# EAGLE design antenna_analyzer_rev7 (EAGLE 6.6.0)
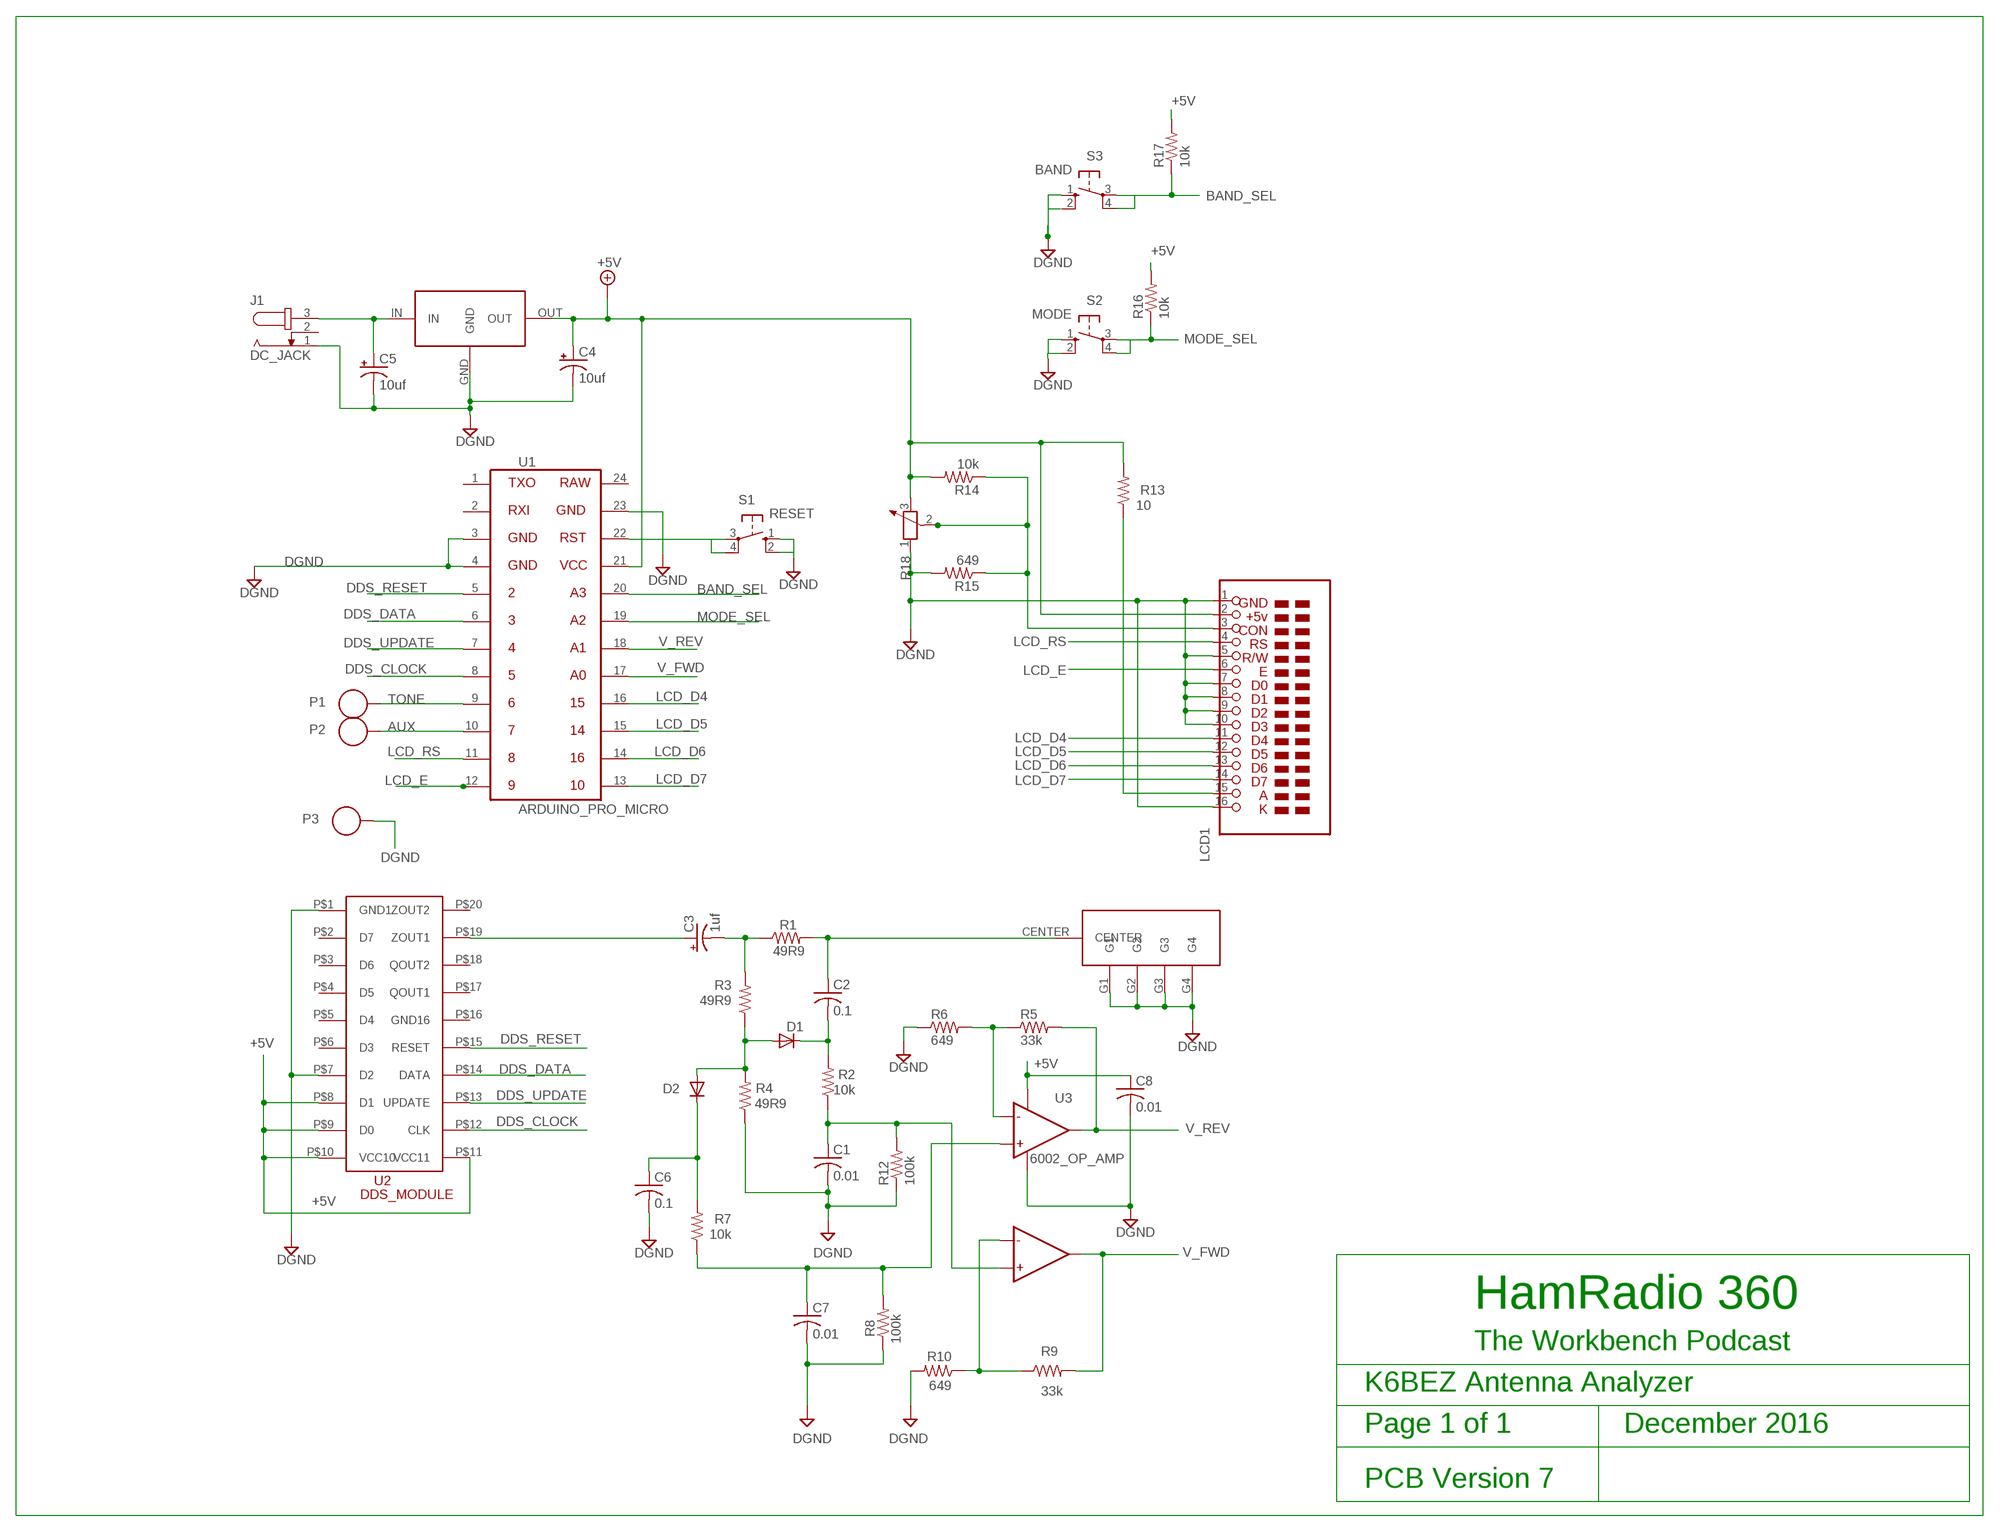
[diagram p0: schematic, sheet 1]

## Parts
C1  0.01  C-US025-025X050  [C025-025X050]
C2  0.1  C-US025-025X050  [C025-025X050]
C3  1uf  CPOL-USE1.8-4  [E1,8-4]
C4  10uf  CPOL-USE1.8-4  [E1,8-4]
C5  10uf  CPOL-USE1.8-4  [E1,8-4]
C6  0.1  C-US025-025X050  [C025-025X050]
C7  0.01  C-US025-025X050  [C025-025X050]
C8  0.01  C-US025-025X050  [C025-025X050]
CON1  BNC-SMALL  [BNC-SMALL]
D1  AA143  1N4148DO35-7  [DO35-7]
D2  AA143  1N4148DO35-7  [DO35-7]
J1  DC_JACK  [DC_COAXIAL_JACK]
LCD1  LCD_2_16  [LCD_2X16]
P1  SOLDER_PAD_35_HOLE  [SOLDER_PAD_35_HOLE]
P2  SOLDER_PAD_35_HOLE  [SOLDER_PAD_35_HOLE]
P3  SOLDER_PAD_35_HOLE  [SOLDER_PAD_35_HOLE]
R1  49R9  R-US_0207/10  [0207/10]
R2  10k  R-US_0207/10  [0207/10]
R3  49R9  R-US_0207/10  [0207/10]
R4  49R9  R-US_0207/10  [0207/10]
R5  33k  R-US_0207/10  [0207/10]
R6  649  R-US_0207/10  [0207/10]
R7  10k  R-US_0207/10  [0207/10]
R8  100k  R-US_0207/10  [0207/10]
R9  33k  R-US_0207/10  [0207/10]
R10  649  R-US_0207/10  [0207/10]
R12  100k  R-US_0207/10  [0207/10]
R13  10  R-US_0207/10  [0207/10]
R14  10k  R-US_0207/10  [0207/10]
R15  649  R-US_0207/10  [0207/10]
R16  10k  R-US_0207/10  [0207/10]
R17  10k  R-US_0207/10  [0207/10]
R18  R-POTENTIOMETER-3362U  [3362U]
S1  RESET  10-XX  [B3F-10XX]
S2  MODE  10-XX  [B3F-10XX]
S3  BAND  10-XX  [B3F-10XX]
U1  ARDUINO_PRO_MICRO  [ARDUINO_PRO_MICRO]
U2  AD9850_MOD  [DDS_DIL]
U3  6002_OP_AMP  [OP_AMP_8_PIN]
U5  SWITCHING_REGULATOR  [SWITCHING_REGULATOR]

## Nets
+5V: C4.+ C8.1 LCD1.2 R13.2 R14.2 R16.2 R17.2 R18.3 U1.21 U2.P$8(D1) U2.P$9(D0) U2.P$10(VCC10) U2.P$11(VCC11) U3.8(VCC+) U5.OUT
AUX: P2.1 U1.10
BAND_SEL: R17.1 S3.3(P) S3.4(P1) U1.20
DDS_CLOCK: U1.8 U2.P$12(CLK)
DDS_DATA: U1.6 U2.P$14(DATA)
DDS_RESET: U1.5 U2.P$15(RESET)
DDS_UPDATE: U1.7 U2.P$13(UPDATE)
DGND: C1.2 C4.- C5.- C6.2 C7.2 C8.2 CON1.G1 CON1.G2 CON1.G3 CON1.G4 J1.1 LCD1.1 LCD1.5 LCD1.7 LCD1.8 LCD1.9 LCD1.10 LCD1.16 P3.1 R4.1 R6.1 R8.1 R10.2 R12.1 R15.2 R18.1 S1.1(S) S1.2(S1) S2.1(S) S2.2(S1) S3.1(S) U1.3 U1.4 U1.23 U2.P$1(GND1) U2.P$7(D2) U3.4(VCC-) U5.GND
LCD_D4: LCD1.11 U1.16
LCD_D5: LCD1.12 U1.15
LCD_D6: LCD1.13 U1.14
LCD_D7: LCD1.14 U1.13
LCD_E: LCD1.6 U1.12
LCD_RS: LCD1.4 U1.11
MODE_SEL: R16.1 S2.3(P) S2.4(P1) U1.19
N$1: C5.+ J1.3 U5.IN
N$2: C6.1 D2.C R7.2
N$3: C3.+ U2.P$19(ZOUT1)
N$5: C3.- R1.1 R3.2
N$6: D1.A D2.A R3.1 R4.2
N$7: C2.1 CON1.CENTER R1.2
N$9: C2.2 D1.C R2.2
N$10: C1.1 R2.1 R12.2 U3.5(IN+2)
N$11: C7.1 R7.1 R8.2 U3.3(IN+1)
N$12: S1.3(P) S1.4(P1) U1.22
N$13: R9.1 R10.1 U3.6(IN-2)
N$17: R5.1 R6.2 U3.2(IN-1)
N$37: LCD1.15 R13.1
N$40: LCD1.3 R14.1 R15.1 R18.2
TONE: P1.1 U1.9
V_FWD: R9.2 U1.17 U3.7(OUT2)
V_REV: R5.2 U1.18 U3.1(OUT1)
Unconnected: J1.2 S3.2(S1) U1.1 U1.2 U1.24 U2.P$2(D7) U2.P$3(D6) U2.P$4(D5) U2.P$5(D4) U2.P$6(D3) U2.P$16(GND16) U2.P$17(QOUT1) U2.P$18(QOUT2) U2.P$20(ZOUT2)

## Notes on the sheet
- HamRadio 360
- The Workbench Podcast
- K6BEZ Antenna Analyzer
- Page 1 of 1              December 2016
- PCB Version 7

## Library data of the parts
C1 C2 C6-C8 = resistor:C-US: CAPACITOR, American symbol
C3-C5 = resistor:CPOL-US: POLARIZED CAPACITOR, American symbol
CON1 = srs_lib_4:BNC-SMALL
D1 D2 = diode:1N4148: DIODE high speed (Philips)
J1 = srs_lib_2:DC_JACK
LCD1 = srs_lib_4:LCD_2_16
P1-P3 = srs_lib_4:SOLDER_PAD_35_HOLE
R1-R10 R12-R17 = adafruit:R-US_: RESISTOR, American symbol
R18 = Discrete:R-POTENTIOMETER*: Potentiometer
S1-S3 = switch-omron:10-XX: OMRON SWITCH; MPN: B3F-1000; OC_FARNELL: 176432; OC_NEWARK: 36M3542
U1 = srs_lib_4:ARDUINO_PRO_MICRO
U2 = BericLib:AD9850_MOD
U3 = srs_lib_4:6002_OP_AMP
U5 = srs_new:SWITCHING_REGULATOR

## Board
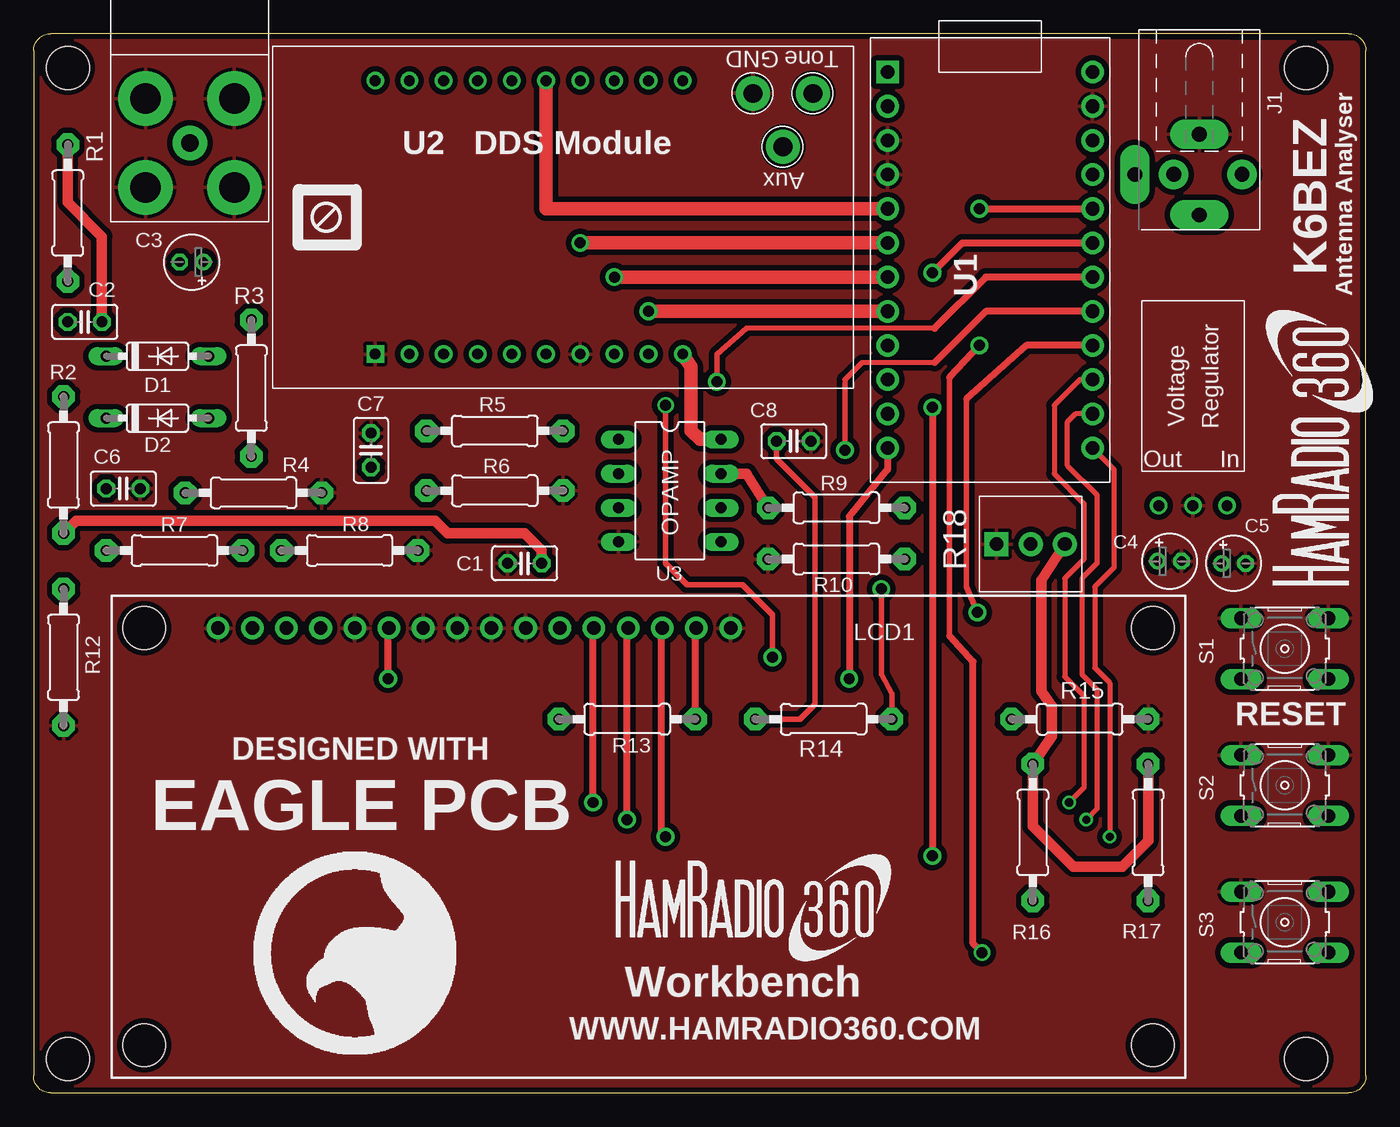
[diagram p1: board, top side]
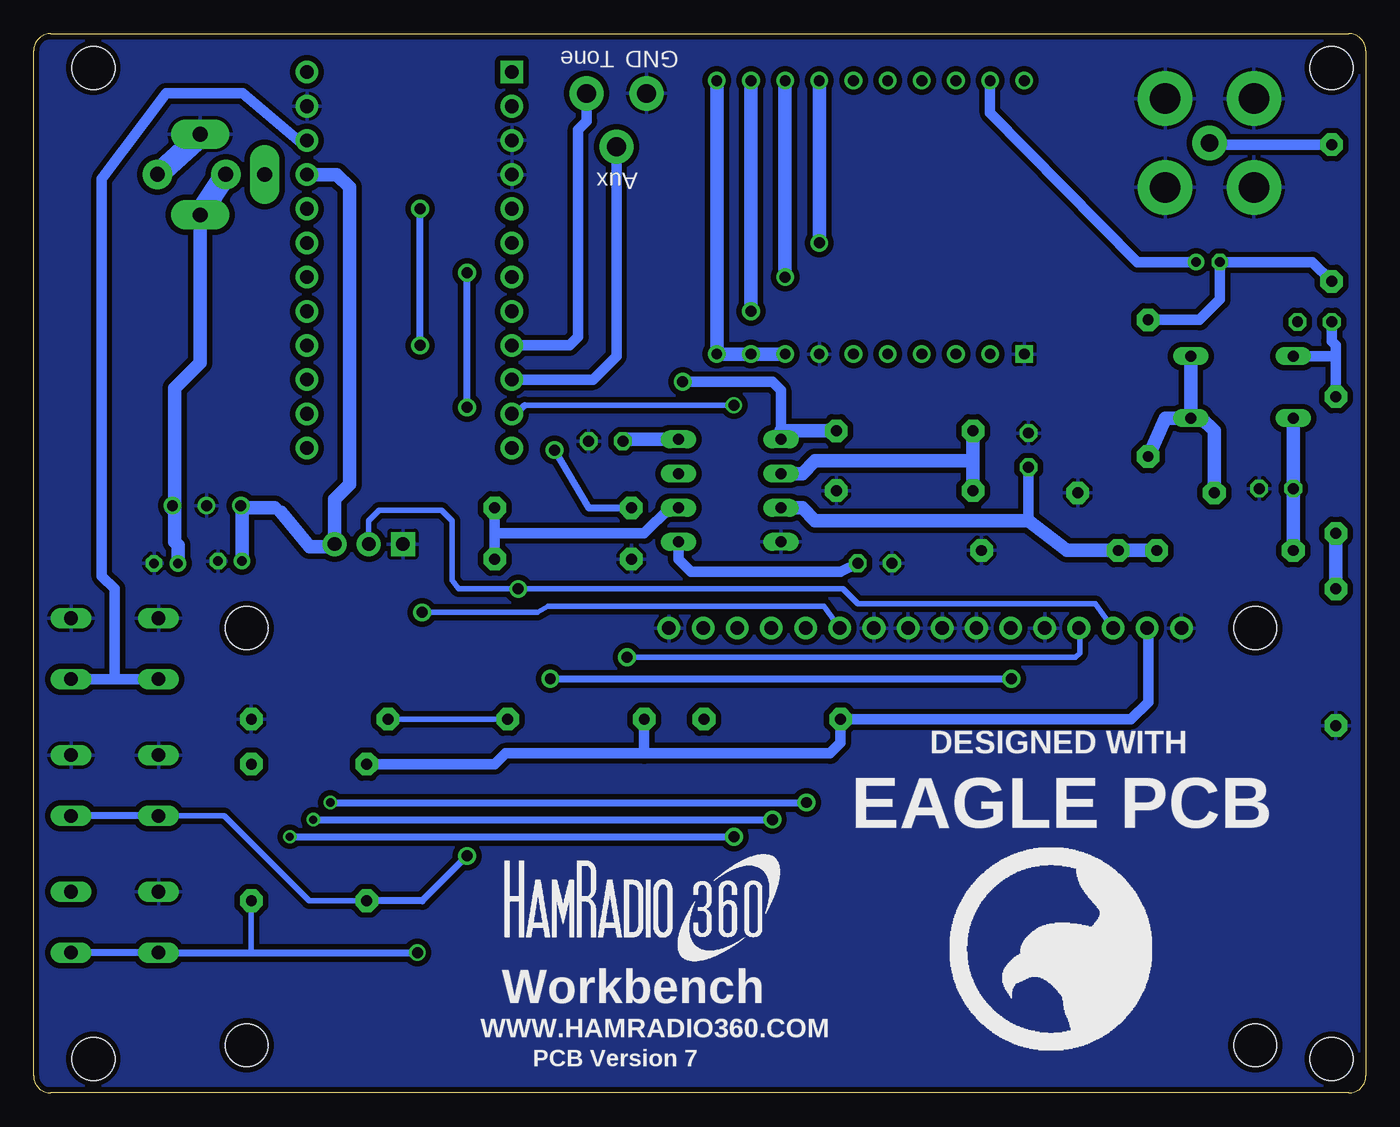
[diagram p2: board, bottom side, seen from below]

Size 99.06 x 78.74 mm. Coordinates in mm from the lower left corner, seen from the top.
Outline: 1.27,0 97.79,0 arc90 99.06,1.27 99.06,77.47 arc90 97.79,78.74 1.27,78.74 arc90 0,77.47 0,1.27 arc90 1.27,0
Copper layers (1*16): Top 0.035mm / dielectric 1.5mm / Bottom 0.035mm
Design rules "SeeedStudio_2layer_DRU_no_angle_20140221": minimum track width 6mil, minimum drill 12mil, track to track 6mil, track to pad 6mil, pad to pad 6mil, via to via 6mil, smd to smd 0mil, copper to edge 10mil, drill to drill 10mil, minimum pad ring 10mil, minimum via ring 6mil, stop-mask expansion 2mil, vias tented up to drill 100mil, thermal gap 10mil
Holes 3.2 mm at 94.61,2.54 2.54,76.2 94.61,76.2 2.54,2.54

### Footprints (pad centres in the part's own frame; a part is rotated, then mirrored left to right if it is on the bottom)
C025-025X050 = drill 0.813 octagon: 1 -1.27,0; 2 1.27,0
E1,8-4 = drill 0.711 pad 1.168: + -0.889,0 | drill 0.711 pad 1.168 octagon: - 0.889,0
BNC-SMALL = drill 1.27 pad 2.54: CENTER 3.299,3.299 | drill 2.261 pad 4.064: G1 0,6.599; G2 0,0; G3 6.599,0; G4 6.599,6.599
DO35-7 = drill 0.813 long: A 3.81,0; C -3.81,0
DC_COAXIAL_JACK = drill 1.1 pad 2.184 long: 1 -3.953,0; 2 -0.953,-4.8; 3 2.047,0 | drill 1.1 pad 2.184: 4 -0.969,-1.905; 5 -0.969,3.175
LCD_2X16 = drill 1 pad 1.676: 1 -32,7.88; 2 -29.46,7.88; 3 -26.92,7.88; 4 -24.38,7.88; 5 -21.84,7.88; 6 -19.3,7.88; 7 -16.76,7.88; 8 -14.22,7.88; 9 -11.68,7.88; 10 -9.14,7.88; 11 -6.6,7.88; 12 -4.06,7.88; 13 -1.52,7.88; 14 1.02,7.88; 15 3.56,7.88; 16 6.1,7.88 | hole 3.2: -37.5,-23.12; 37.5,-23.12; -37.5,7.88; 37.5,7.88
SOLDER_PAD_35_HOLE = drill 1.4 pad 2.54: 1 0,0
0207/10 = drill 0.813 pad 1.676 octagon: 1 -5.08,0; 2 5.08,0
3362U = drill 1.016 pad 1.778 square: 1 0,2.54 | drill 1.016 pad 1.778: 2 2.54,2.54; 3 5.08,2.54
B3F-10XX = drill 1.016 long: 1 -3.251,2.261; 2 3.251,2.261; 3 -3.251,-2.261; 4 3.251,-2.261
ARDUINO_PRO_MICRO = drill 1.016 pad 1.676 square: 1 0,0 | drill 1.016 pad 1.676: 2 0,-2.54; 3 0,-5.08; 4 0,-7.62; 5 0,-10.16; 6 0,-12.7; 7 0,-15.24; 8 0,-17.78; 9 0,-20.32; 10 0,-22.86; 11 0,-25.4; 12 0,-27.94; 13 15.24,-27.94; 14 15.24,-25.4; 15 15.24,-22.86; 16 15.24,-20.32; 17 15.24,-17.78; 18 15.24,-15.24; 19 15.24,-12.7; 20 15.24,-10.16; 21 15.24,-7.62; 22 15.24,-5.08; 23 15.24,-2.54; 24 15.24,0
DDS_DIL = drill 0.8 square: P$1 -6.35,6.35 | drill 0.8: P$2 -6.35,3.81; P$3 -6.35,1.27; P$4 -6.35,-1.27; P$5 -6.35,-3.81; P$6 -6.35,-6.35; P$7 -6.35,-8.89; P$8 -6.35,-11.43; P$9 -6.35,-13.97; P$10 -6.35,-16.51; P$11 13.97,-16.51; P$12 13.97,-13.97; P$13 13.97,-11.43; P$14 13.97,-8.89; P$15 13.97,-6.35; P$16 13.97,-3.81; P$17 13.97,-1.27; P$18 13.97,1.27; P$19 13.97,3.81; P$20 13.97,6.35
OP_AMP_8_PIN = drill 0.813 long: 1 -3.81,-3.81; 2 -1.27,-3.81; 3 1.27,-3.81; 4 3.81,-3.81; 5 3.81,3.81; 6 1.27,3.81; 7 -1.27,3.81; 8 -3.81,3.81
SWITCHING_REGULATOR = drill 0.8: GND 0,0; IN 2.54,0; OUT -2.54,0

### Placement (x,y rotation side)
C1  36.51,39.37 180 top
C2  3.81,57.31 180 top
C3  11.75,61.75 180 top
C4  84.45,39.53 0 top
C5  89.22,39.37 0 top
C6  6.67,44.93 0 top
C7  25.08,47.78 90 top
C8  56.52,48.45 0 top
CON1  14.92,67.31 90 top
D1  9.21,54.77 0 top
D2  9.21,50.16 0 top
J1  86.68,67.31 270 top
LCD1  45.72,26.67 0 top
P1  57.94,74.3 0 top
P2  55.72,70.33 0 top
P3  53.5,74.3 0 top
R1  2.54,65.41 90 top
R2  2.22,46.67 90 top
R3  16.19,52.39 90 top
R4  16.35,44.61 180 top
R5  34.29,49.21 0 top
R6  34.29,44.77 180 top
R7  10.48,40.32 180 top
R8  23.5,40.32 180 top
R9  59.69,43.5 180 top
R10  59.69,39.69 180 top
R12  2.22,32.38 90 top
R13  44.13,27.78 180 top
R14  58.74,27.78 180 top
R15  77.79,27.78 0 top
R16  74.3,19.37 90 top
R17  82.87,19.37 90 top
R18  71.6,38.26 0 top
S1  93.03,33.02 0 top
S2  93.03,22.86 0 top
S3  93.03,12.7 0 top
U1  63.5,75.88 0 top
U2  31.75,61.28 90 top
U3  47.31,44.77 270 top
U5  86.2,43.66 0 top
U$1  [CS-2016-LOGO-15MM]  13.65,0.16 0 top
U$2  [CS-2016-LOGO-15MM]  33.66,0.48 0 bottom

### Tracks (layer width: path | path; a pad name or v marks a point on that pad's centre or on a via)
+5V
  Top 0.406: R14.2 56.99,27.78 58.1,28.89 58.1,44.29 55.24,47.15 C8.1
  Top 0.762: R17.2 82.87,18.73 80.96,16.83 77.31,16.83 74.3,19.84 R16.2 75.72,26.51 75.72,28.73 74.93,29.84 74.93,38.1 R18.3
  Top 1.016: U2.P$10 48.9,53.98 48.9,49.21 49.53,48.58 U3.8
  Bottom 0.406: 16.19,34.48 LCD1.2 | 80.64,43.18 80.8,43.18 81.12,43.5 | 83.57,43.66 83.57,43.5 | 83.31,43.5 83.66,43.5 U5.OUT
  Bottom 0.762: 16.19,34.48 16.19,29.05 17.46,27.78 R13.2 39.05,26.04 39.85,25.24 53.66,25.24 | R14.2 53.66,25.24 | 53.66,25.24 63.98,25.24 64.77,24.45 R16.2 | R18.3 76.87,40.61
  Bottom 1.016: U2.P$11 U2.P$10 U2.P$9 U2.P$8 | U3.8 55.12,48.58 C8.1 | 80.64,43.18 78.55,40.61 76.87,40.61 | C4.+ 83.57,43.5 | 81.12,43.5 83.31,43.5 | U1.21 76.52,68.26 75.56,67.31 75.56,45.24 76.68,44.13 R18.3
  Bottom 1.27: U5.OUT 83.57,43.66
AUX
  Bottom 0.762: U1.10 57.47,53.02 55.72,54.77 P2.1
BAND_SEL  (via drill 0.81 pad 0.99, 0.81 pad 1.32)
  Top 0.406: 68.1,53.18 68.1,33.97
  Top 0.508: v70.33,55.56 68.1,53.18 | 68.1,33.97 69.85,32.07 69.85,11.11 v70.52,10.44 | v70.33,65.72 U1.20
  Bottom 0.406: R17.1 82.87,10.44
  Bottom 0.508: S3.4 S3.3 82.87,10.44 v70.52,10.44 | v70.33,55.56 v70.33,65.72
DDS_CLOCK  (via drill 0.81 pad 1.32)
  Top 1.016: v45.72,58.1 U1.8
  Bottom 1.016: U2.P$12 v45.72,58.1
DDS_DATA  (via drill 0.81 pad 1.32)
  Top 1.016: v40.64,63.18 U1.6
  Bottom 1.016: U2.P$14 v40.64,63.18
DDS_RESET
  Top 1.016: U1.5 38.1,65.72 U2.P$15
DDS_UPDATE  (via drill 0.81 pad 1.32)
  Top 1.016: U1.7 v43.18,60.64
  Bottom 1.016: v43.18,60.64 U2.P$13
DGND
  pour Bottom (isolate 0.406): 0,0 99.89,-1.91 100.2,78.74 0,78.74
  pour Top (isolate 0.406): 0,0 100.84,-0.64 100.84,78.11 0,78.74
LCD_D4  (via drill 0.81 pad 1.32)
  Top 0.406: 69.37,51.59 69.37,37.62 v70.17,35.72
  Top 0.508: U1.16 73.82,55.56 69.37,51.59
  Bottom 0.406: v70.17,35.72 61.59,35.72 60.8,36.2 40.29,36.2 LCD1.11
LCD_D5  (via drill 0.6 pad 0.99, 0.81 pad 1.32)
  Top 0.381: U1.15 77.79,53.02 75.88,51.12 75.88,46.04 78.11,43.81 78.11,39.69 76.68,38.26 76.68,30.96 78.11,29.53 78.11,22.7 v76.99,21.59
  Top 0.406: 41.59,34.48 LCD1.12
  Top 0.508: v41.59,21.59 41.59,34.48
  Bottom 0.508: v76.99,21.59 v41.59,21.59
LCD_D6  (via drill 0.6 pad 0.99, 0.81 pad 1.32)
  Top 0.381: U1.14 77.47,50.48 76.83,49.85 76.83,46.67 79.06,44.45 79.06,39.37 77.95,38.26 77.95,31.11 79.06,30 79.06,21.11 v78.26,20.32
  Top 0.406: 44.13,34.48 LCD1.13
  Top 0.508: v44.13,20.32 44.13,34.48
  Bottom 0.508: v78.26,20.32 v44.13,20.32
LCD_D7  (via drill 0.6 pad 0.99, 0.81 pad 1.32)
  Top 0.381: U1.13 80.33,46.35 80.33,39.05 78.9,37.62 78.9,31.59 80.01,30.48 v80.01,19.05
  Top 0.406: 46.67,34.48 LCD1.14
  Top 0.508: v46.99,19.05 46.67,19.37 46.67,34.48
  Bottom 0.508: v80.01,19.05 v46.99,19.05
LCD_E  (via drill 0.81 pad 1.32)
  Top 0.406: 26.35,34.48 LCD1.6
  Top 0.508: U1.12 63.5,46.35 60.64,42.86 v60.64,30.8 | v26.35,30.8 26.35,34.48
  Bottom 0.508: v60.64,30.8 v26.35,30.8
LCD_RS  (via drill 0.81 pad 0.99, 0.81 pad 1.32)
  Top 0.406: v46.99,51.12 46.99,39.37 48.58,37.78 52.7,37.78 54.93,35.56 v54.93,32.38
  Bottom 0.406: 62.55,51.12 v46.99,51.12 | v54.93,32.38 21.59,32.38 21.27,32.7 21.27,34.48 LCD1.4
  Bottom 0.508: U1.11 63.18,50.48 62.55,51.12
MODE_SEL  (via drill 0.81 pad 1.32)
  Top 0.508: v66.83,50.96 v66.83,17.62 | v66.83,60.96 69.06,63.18 U1.19
  Bottom 0.406: S2.3 84.89,20.6 78.58,14.29 R16.1
  Bottom 0.508: v66.83,17.62 70.17,14.29 R16.1 | S2.3 S2.4 | v66.83,50.96 v66.83,60.96
N$1
  Bottom 0.406: U5.IN 88.58,43.66 88.58,43.69 | 88.58,43.56 88.74,43.56
  Bottom 1.016: C5.+ 88.33,40.7 88.58,40.96 88.58,43.56 | J1.3 86.68,54.29 88.58,52.39 88.58,43.69
  Bottom 1.27: 88.74,43.56 U5.IN
N$2
  Bottom 1.016: D2.C C6.1 R7.2
N$3
  Bottom 0.762: C3.+ 16.99,61.75 27.94,72.87 U2.P$19
N$5
  Bottom 0.762: R1.1 3.97,61.75 C3.- 10.86,58.99 12.38,57.47 R3.2
N$6
  Bottom 1.016: D1.A D2.A | D2.A 14.92,50.16 R3.1 | D2.A 12.22,50.16 11.27,49.21 R4.2
N$7
  Top 0.762: C2.1 5.08,63.66 2.54,66.2 R1.2
  Bottom 0.762: R1.2 11.5,70.48 CON1.CENTER
N$9
  Bottom 0.762: D1.C 2.22,54.77 | 2.22,54.77 R2.2 | C2.2 2.54,55.88 2.22,55.56 2.22,54.77
N$10
  Top 0.762: C1.1 37.78,40.32 36.51,41.59 30.8,41.59 29.84,42.55 3.17,42.55 R2.1
  Bottom 0.762: C1.1 39.05,38.73 50.16,38.73 51.12,39.69 U3.5
  Bottom 1.016: R12.2 R2.1
N$11
  Bottom 0.762: C7.1 25.08,42.55
  Bottom 1.016: R7.1 R8.2 22.23,40.32 25.08,42.55 40.96,42.55 41.91,43.5 U3.3
N$12
  Bottom 0.406: S1.3 90.77,30.76
  Bottom 0.762: S1.3 93.03,30.76 | 93.03,30.76 S1.4 | U1.22 79.38,70.8 83.5,74.3 89.22,74.3 93.98,67.94 93.98,38.42 93.03,37.47 93.03,30.76
N$13
  Bottom 0.406: U3.6 51.75,43.5
  Bottom 0.762: R10.1 64.77,41.59 | 64.77,41.59 R9.1 | 51.75,43.5 53.66,41.59 64.77,41.59
N$17
  Bottom 1.016: R5.1 29.21,46.99 | 29.21,46.99 R6.2 | U3.2 41.91,46.04 40.96,46.99 29.21,46.99
N$37
  Top 0.406: 49.21,34.48 LCD1.15
  Top 0.508: R13.1 49.21,34.48
N$40  (via drill 0.81 pad 1.32)
  Top 0.406: R14.1 63.82,29.69 63.02,31.11 v63.02,37.47
  Bottom 0.406: LCD1.3 20.13,36.35 37.78,36.35 38.89,37.47 v63.02,37.47 67.47,37.47 67.94,38.1 67.94,42.55 68.71,43.31 73.37,43.31 74.14,42.55 R18.2 | R15.1 R14.1
TONE
  Bottom 0.762: U1.9 59.21,55.56 58.58,56.2 58.58,71.6 57.94,72.23 P1.1
V_FWD  (via drill 0.81 pad 1.32)
  Top 0.381: 66.99,54.29 61.59,54.29 60.33,53.02 60.33,52.7
  Top 0.406: 60.33,52.7 v60.33,47.78
  Top 0.508: U1.17 70.8,58.1 66.99,54.29
  Top 0.762: U3.7 53.02,46.04 R9.2
  Bottom 0.508: v60.33,47.78 57.78,43.5 R9.2
V_REV  (via drill 0.81 pad 1.32)
  Top 0.381: 66.99,56.83 53.02,56.83
  Top 0.406: 53.02,56.83 50.8,54.93 v50.8,52.86
  Top 0.508: U1.18 70.8,60.64 66.99,56.83
  Bottom 0.762: v50.8,52.86 44.13,52.86 43.5,52.23 43.5,49.21
  Bottom 1.016: U3.1 43.5,49.21 R5.2

### Text on the board
tPlace: GND | Tone | DDS Module | Aux | K6BEZ | Antenna Analyser | Voltage | Regulator | Out | In | OPAMP | DESIGNED WITH | EAGLE PCB | Workbench | WWW.HAMRADIO360.COM
bPlace: GND | Tone | Aux | DESIGNED WITH | EAGLE PCB | Workbench | WWW.HAMRADIO360.COM | PCB Version 7
_tsilk: J5 | DC_JACK | E L E C T R O N I C S | J4 | J1 | C4 | 1-227161-0 | J3 | 1uf | C17 | C16 | 49R9 | C2 | 100n | C18 | C19 | C14 | C11 | U1 | R3 | 100n | 1uf | 1uf | 10uf | C5 | DDS Module | C3 | LED3 | 1uf | 1uf | 10uf | 100n | 49R9 | R4 | R5 | U6 | D2 | MAX232 | U7 | 49R9 | R13 | 270 | 7805 | AA143 | 270 | R12 | D3 | 100n | C20 | AA143 | LED2 | JP2 | JP1 | 10 | R20 | U2 | C9 | 100n | USB | USB | 1 | 2 | 3 | 1 | 2 | 3 | C15 | 100n | R9 | 649 | R19 | 10k | 10k\ | R8 | 22k | LED1 | R6 | R10 | 10n | C8 | 10n | 270 | RST | 100k | U3 | R14 | R11 | C7 | U5 | S5 | R7 | 100k | R15 | 22k | S1 | 100n | 649 | 10k | C6 | 10n | 10k | R1 | Y1 | R17 | R16 | C1 | 10 MHz | R2 | C12 | 22p | C13 | 22p | MODE | 10k | DIS1 | J6 | K6BEZ Antenna Analyser V1.1